# EAGLE schematic octanis_v1 (EAGLE 7.2.0)
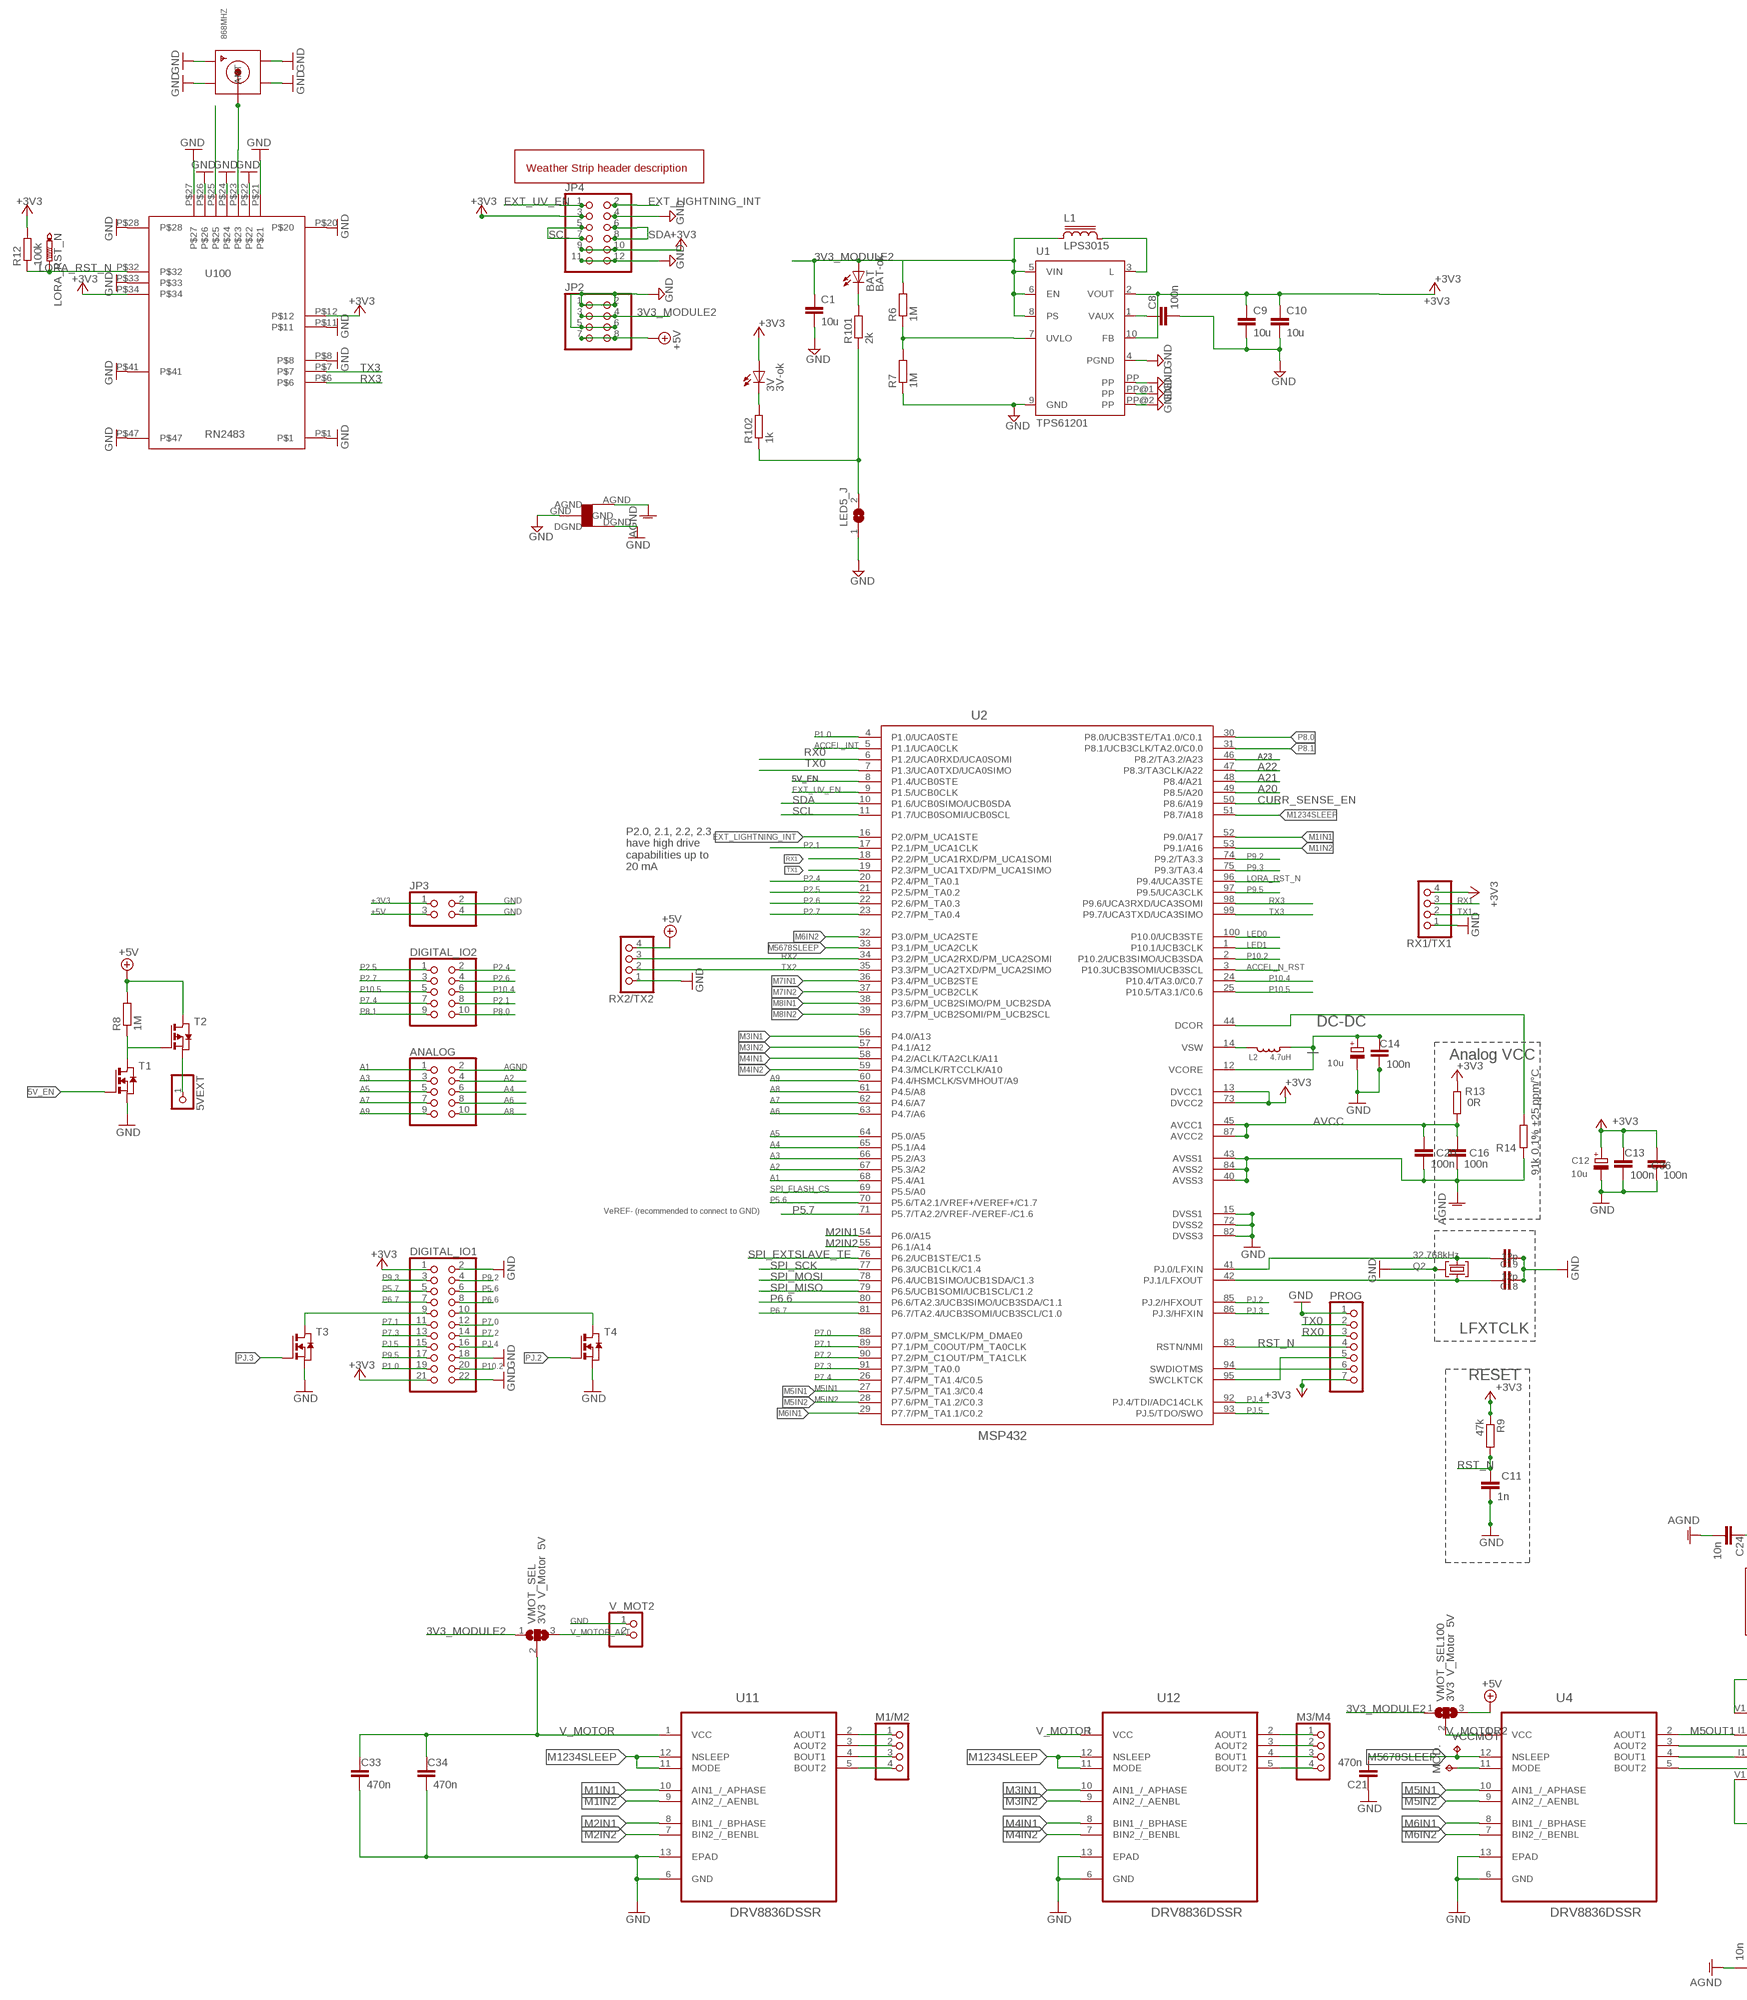
[diagram p0: schematic, sheet 1, part 1 of 2]
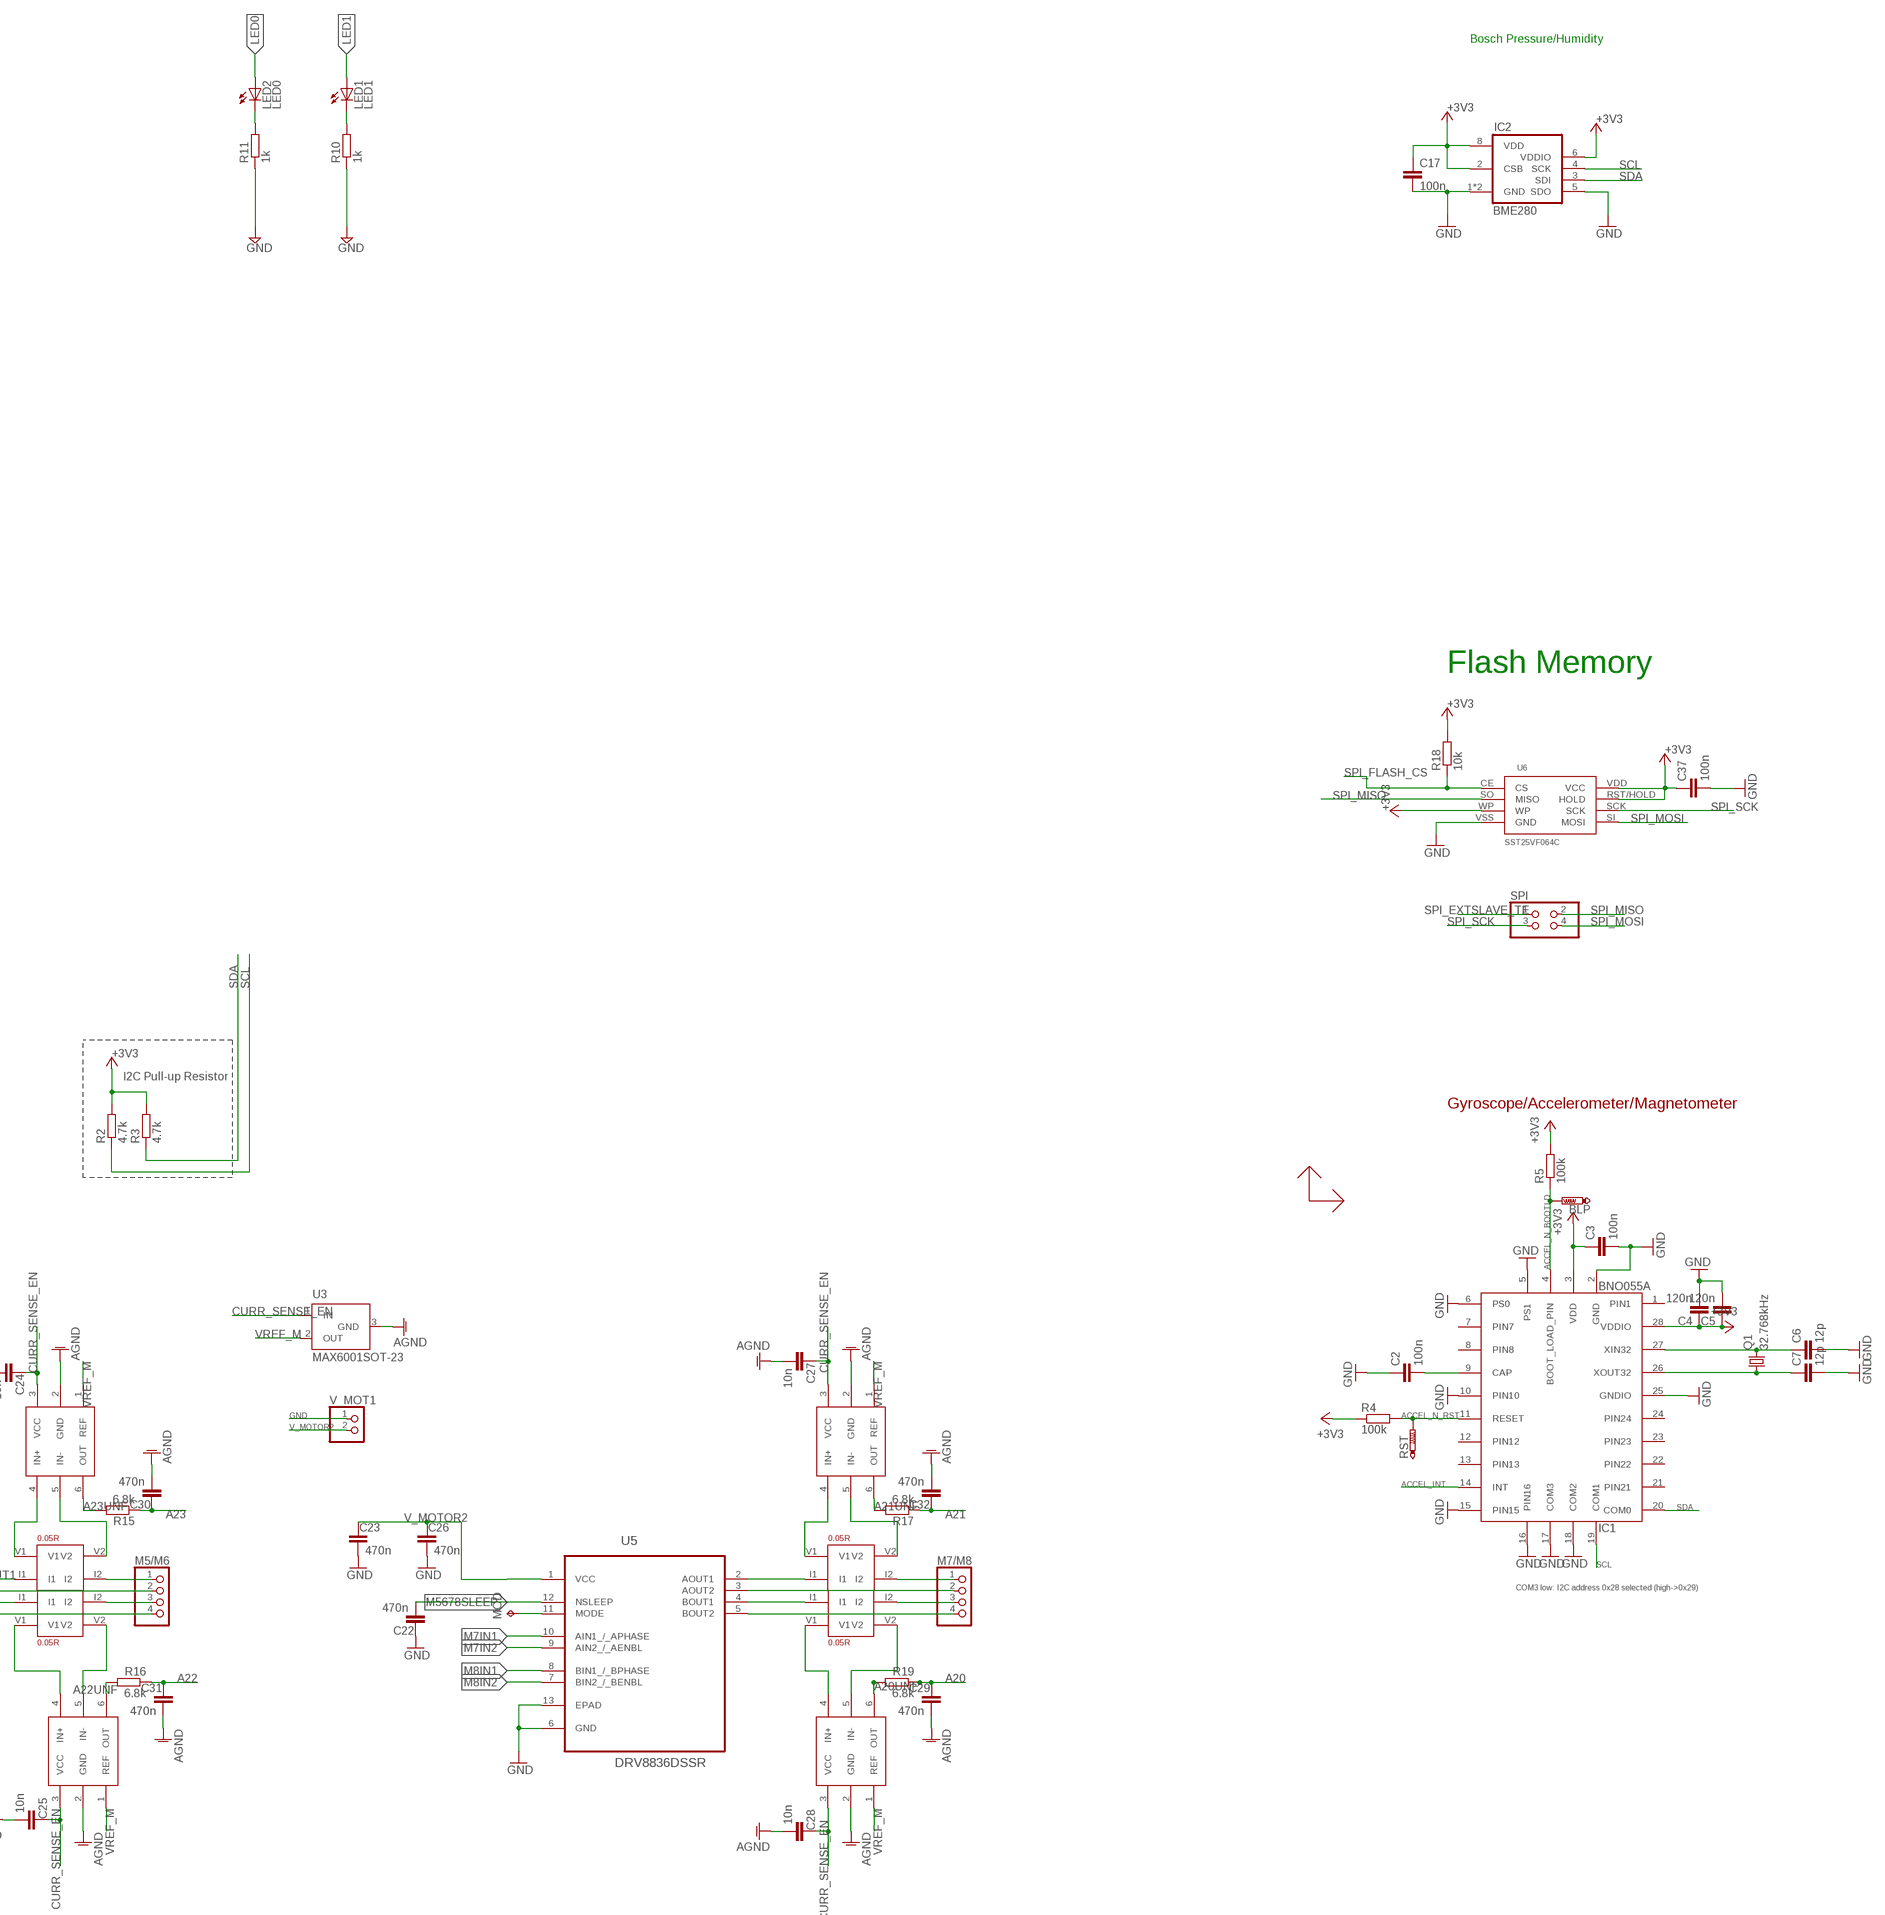
[diagram p1: schematic, sheet 1, part 2 of 2]

## Parts
3V  3V-ok  LEDCHIPLED_0603  [CHIPLED_0603]
5VEXT  PINHD-1X1  [1X01]
868MHZ  SMACONNECTOR_EDGE  [SMA_EDGELAUNCH]
ANALOG  PINHD-2X5  [2X05]
BAT  BAT-ok  LEDCHIPLED_0603  [CHIPLED_0603]
BLP  PTR1B1,27  [B1,27]
C1  10u  C-EUC0805K  [C0805K]
C2  100n  C-EUC0603  [C0603]
C3  100n  C-EUC0603  [C0603]
C4  120n  C-EUC0603  [C0603]
C5  120n  C-EUC0603  [C0603]
C6  12p  C-EUC0603  [C0603]
C7  12p  C-EUC0603  [C0603]
C8  100n  C-EUC0603  [C0603]
C9  10u  C-EUC0805K  [C0805K]
C10  10u  C-EUC0805K  [C0805K]
C11  1n  C-EUC0603  [C0603]
C12  10u  CPOL-EUA/3216-18R  [A/3216-18R]
C13  100n  C-EUC0603  [C0603]
C14  100n  C-EUC0603  [C0603]
C15  10u  CPOL-EUA/3216-18R  [A/3216-18R]
C16  100n  C-EUC0402  [C0402]
C17  100n  C-EUC0603  [C0603]
C18  12p  C-EUC0402  [C0402]
C19  12p  C-EUC0402  [C0402]
C20  100n  C-EUC0402  [C0402]
C21  470n  C-EUC0603  [C0603]
C22  470n  C-EUC0603  [C0603]
C23  470n  C-EUC0603  [C0603]
C24  10n  C-EUC0603  [C0603]
C25  10n  C-EUC0603  [C0603]
C26  470n  C-EUC0603  [C0603]
C27  10n  C-EUC0603  [C0603]
C28  10n  C-EUC0603  [C0603]
C29  470n  C-EUC0603  [C0603]
C30  470n  C-EUC0603  [C0603]
C31  470n  C-EUC0603  [C0603]
C32  470n  C-EUC0603  [C0603]
C33  470n  C-EUC0603  [C0603]
C34  470n  C-EUC0603  [C0603]
C36  100n  C-EUC0603  [C0603]
C37  100n  C-EUC0603  [C0603]
DIGITAL_IO1  PINHD-2X11  [2X11]
DIGITAL_IO2  PINHD-2X5  [2X05]
IC1  BNO055A  [BNO055]
IC2  BME280  [BME280]
JP2  PINHD-2X04_2.54  [2X04]
JP3  PINHD-2X2  [2X02]
JP4  PINHD-2X06_2.54-SMD  [2X06SMD]
L1  LPS3015  [LPS3015]
L2  4.7uH  LQM2MP_G0  [0806]
LED1  LED1  LEDCHIPLED_0603  [CHIPLED_0603]
LED2  LED0  LEDCHIPLED_0603  [CHIPLED_0603]
LED5_J  SJ  [SJ]
LORA_RST_N  PTR1TP15R  [TP15R]
M1/M2  PINHD-1X04_2.54-S  [1X04-S]
M3/M4  PINHD-1X04_2.54-S  [1X04-S]
M5/M6  PINHD-1X04_2.54-S  [1X04-S]
M7/M8  PINHD-1X04_2.54-S  [1X04-S]
MOD  TPTP06R  [TP06R]
MOD.  TPTP06R  [TP06R]
PROG  PINHD-1X72MM_SMD  [1X7SMD]
Q1  32.768kHz  FC-12M  [FC-12M]
Q2  32.768kHz  MS3V-T1R  [MS3V-T1R]
R2  4.7k  R-EU_R0603  [R0603]
R3  4.7k  R-EU_R0603  [R0603]
R4  100k  R-EU_R0603  [R0603]
R5  100k  R-EU_R0603  [R0603]
R6  1M  R-EU_R0603  [R0603]
R7  1M  R-EU_R0603  [R0603]
R8  1M  R-EU_R0603  [R0603]
R9  47k  R-EU_R0603  [R0603]
R10  1k  R-EU_R0603  [R0603]
R11  1k  R-EU_R0603  [R0603]
R12  100k  R-EU_R0603  [R0603]
R13  0R  R-EU_R0402  [R0402]
R14  91k 0.1% ±25 ppm/°C  R-EU_R0402  [R0402]
R15  6.8k  R-EU_R0603  [R0603]
R16  6.8k  R-EU_R0603  [R0603]
R17  6.8k  R-EU_R0603  [R0603]
R18  10k  R-EU_R0603  [R0603]
R19  6.8k  R-EU_R0603  [R0603]
R101  2k  R-EU_R0603  [R0603]
R102  1k  R-EU_R0603  [R0603]
RS1  0.05R  CURRENT_RESISTOR  [4PADS_RESISTOR]
RS2  0.05R  CURRENT_RESISTOR  [4PADS_RESISTOR]
RS3  0.05R  CURRENT_RESISTOR  [4PADS_RESISTOR]
RS4  0.05R  CURRENT_RESISTOR  [4PADS_RESISTOR]
RST  PTR1B1,27  [B1,27]
RX1/TX1  PINHD-1X04_2.54-S  [1X04-S]
RX2/TX2  PINHD-1X04_2.54-S  [1X04-S]
SPI  PINHD-2X2  [2X02]
T1  NMOSSOT23  [SOT-23]
T2  PMOSSOT23  [SOT-23]
T3  NMOSSOT23  [SOT-23]
T4  NMOSSOT23  [SOT-23]
U1  TPS61201  [S-PDSO-N10]
U2  MSP432  [PZ100]
U3  MAX6001SOT-23  [MAX6001]
U4  DRV8836DSSR  [SON50P200X300X80-13N]
U5  DRV8836DSSR  [SON50P200X300X80-13N]
U6  SST25VF064C  [SOIC_8-LEAD]
U7  INA210  INA213  [SC70-6]
U8  INA210  INA213  [SC70-6]
U9  INA210  INA213  [SC70-6]
U10  INA210  INA213  [SC70-6]
U11  DRV8836DSSR  [SON50P200X300X80-13N]
U12  DRV8836DSSR  [SON50P200X300X80-13N]
U100  RN2483  [RN2483]
U$1  WEATHER_STRIP_DOCU  [WEATHER_STRIP_DOCU]
U$2  STARGND  [STAR]
U$3  BNO055_COORDINATES  [BNO055_COORDINATES]
V_MOT1  PINHD-1X02_2.54-S  [1X02-S]
V_MOT2  PINHD-1X02_2.54-S  [1X02-S]
VCCMOT  TPTP06R  [TP06R]
VMOT_SEL  3V3 V_Motor 5V  SJ2W  [SJ_2]
VMOT_SEL100  3V3 V_Motor 5V  SJ2W  [SJ_2]

## Nets
3V3_MODULE2 [power]: BAT.A C1.1 JP2.3 JP2.4 L1.1 R6.2 U1.5(VIN) U1.6(EN) U1.8(PS) VMOT_SEL100.1 VMOT_SEL.1
5V_EN: T1.3(G) U2.8(P1.4/UCB0STE)
+3V3 [power]: 3V.A C3.1 C4.1 C5.1 C9.1 C10.1 C12.+ C13.2 C17.1 C36.2 C37.1 DIGITAL_IO1.1 DIGITAL_IO1.21 IC1.3(VDD) IC1.28(VDDIO) IC2.2(CSB) IC2.6(VDDIO) IC2.8(VDD) JP3.1 JP4.3 JP4.9 JP4.10 PROG.7 R2.2 R3.2 R4.1 R5.2 R9.1 R12.2 R13.2 R18.2 RX1/TX1.4 U1.2(VOUT) U1.10(FB) U2.13(DVCC1) U2.73(DVCC2) U6.RST/HOLD(HOLD) U6.VDD(VCC) U6.WP U100.P$12 U100.P$34
+5V [fine]: JP2.7 JP2.8 JP3.3 R8.2 RX2/TX2.4 T2.1(D) VMOT_SEL100.3
A1: ANALOG.1 U2.68(P5.4/A1)
A2: ANALOG.4 U2.67(P5.3/A2)
A3: ANALOG.3 U2.66(P5.2/A3)
A4: ANALOG.6 U2.65(P5.1/A4)
A5: ANALOG.5 U2.64(P5.0/A5)
A6: ANALOG.8 U2.63(P4.7/A6)
A7: ANALOG.7 U2.62(P4.6/A7)
A8: ANALOG.10 U2.61(P4.5/A8)
A9: ANALOG.9 U2.60(P4.4/HSMCLK/SVMHOUT/A9)
A20: C29.2 R19.1 U2.49(P8.5/A20)
A20UNF: R19.2 U10.6(OUT)
A21: C32.2 R17.1 U2.48(P8.4/A21)
A21UNF: R17.2 U9.6(OUT)
A22: C31.2 R16.1 U2.47(P8.3/TA3CLK/A22)
A22UNF: R16.2 U8.6(OUT)
A23: C30.2 R15.1 U2.46(P8.2/TA3.2/A23)
A23UNF: R15.2 U7.6(OUT)
ACCEL_INT: IC1.14(INT) U2.5(P1.1/UCA0CLK)
ACCEL_N_BOOTLD: BLP.TP IC1.4(BOOT_LOAD_PIN) R5.1
ACCEL_N_RST: IC1.11(RESET) R4.2 RST.TP U2.3(P10.3UCB3SOMI/UCB3SCL)
AGND [power]: ANALOG.2 C16.2 C20.2 C24.1 C25.1 C27.1 C28.1 C29.1 C30.1 C31.1 C32.1 R14.2 U2.40(AVSS3) U2.43(AVSS1) U2.84(AVSS2) U3.3(GND) U7.2(GND) U8.2(GND) U9.2(GND) U10.2(GND) U$2.AGND
ANT433: U100.P$25
ANT868: 868MHZ.P(ANT) U100.P$23
AVCC [VIN]: C16.1 C20.1 R13.1 U2.45(AVCC1) U2.87(AVCC2)
CURR_SENSE_EN [VIN]: C24.2 C25.2 C27.2 C28.2 U2.50(P8.6/A19) U3.1(IN) U7.3(VCC) U8.3(VCC) U9.3(VCC) U10.3(VCC)
EXT_LIGHTNING_INT: JP4.2 U2.16(P2.0/PM_UCA1STE)
EXT_UV_EN: JP4.1 U2.9(P1.5/UCB0CLK)
GND [power]: 868MHZ.GND@1(GND4) 868MHZ.GND@2(GND3) 868MHZ.GND@3(GND2) 868MHZ.GND@4(GND1) C1.2 C2.1 C3.2 C4.2 C5.2 C6.2 C7.2 C8.2 C9.2 C10.2 C11.1 C12.- C13.1 C14.1 C15.- C17.2 C18.1 C19.1 C21.2 C22.2 C23.1 C26.1 C33.1 C34.1 C36.1 C37.2 DIGITAL_IO1.2 DIGITAL_IO1.18 DIGITAL_IO1.22 IC1.2(GND) IC1.5(PS1) IC1.6(PS0) IC1.10(PIN10) IC1.15(PIN15) IC1.16(PIN16) IC1.17(COM3) IC1.18(COM2) IC1.25(GNDIO) IC2.1(GND) IC2.5(SDO) IC2.7(GND) JP2.1 JP2.2 JP2.5 JP2.6 JP3.2 JP3.4 JP4.4 JP4.11 JP4.12 LED5_J.1 PROG.1 Q2.P3(GND) R7.1 R10.1 R11.1 RX1/TX1.1 RX2/TX2.1 T1.2(S) T3.2(S) T4.2(S) U1.4(PGND) U1.9(GND) U1.PP U1.PP@1(PP) U1.PP@2(PP) U2.15(DVSS1) U2.72(DVSS2) U2.82(DVSS3) U4.6(GND) U4.13(EPAD) U5.6(GND) U5.13(EPAD) U6.VSS(GND) U11.6(GND) U11.13(EPAD) U12.6(GND) U12.13(EPAD) U100.P$1 U100.P$8 U100.P$11 U100.P$20 U100.P$21 U100.P$22 U100.P$24 U100.P$26 U100.P$27 U100.P$28 U100.P$33 U100.P$41 U100.P$47 U$2.DGND U$2.GND V_MOT1.1 V_MOT2.1
L: L1.2 U1.3(L)
LED0: LED2.A U2.100(P10.0/UCB3STE)
LED1: LED1.A U2.1(P10.1/UCB3CLK)
LORA_RST_N: LORA_RST_N.TP R12.1 U2.96(P9.4/UCA3STE) U100.P$32
M1IN1: U2.52(P9.0/A17) U11.10(AIN1_/_APHASE)
M1IN2: U2.53(P9.1/A16) U11.9(AIN2_/_AENBL)
M2IN1: U2.54(P6.0/A15) U11.8(BIN1_/_BPHASE)
M2IN2: U2.55(P6.1/A14) U11.7(BIN2_/_BENBL)
M3IN1: U2.56(P4.0/A13) U12.10(AIN1_/_APHASE)
M3IN2: U2.57(P4.1/A12) U12.9(AIN2_/_AENBL)
M4IN1: U2.58(P4.2/ACLK/TA2CLK/A11) U12.8(BIN1_/_BPHASE)
M4IN2: U2.59(P4.3/MCLK/RTCCLK/A10) U12.7(BIN2_/_BENBL)
M5IN1: U2.27(P7.5/PM_TA1.3/C0.4) U4.10(AIN1_/_APHASE)
M5IN2: U2.28(P7.6/PM_TA1.2/C0.3) U4.9(AIN2_/_AENBL)
M5OUT1: RS1.I1 U4.2(AOUT1)
M6IN1: U2.29(P7.7/PM_TA1.1/C0.2) U4.8(BIN1_/_BPHASE)
M6IN2: U2.32(P3.0/PM_UCA2STE) U4.7(BIN2_/_BENBL)
M7IN1: U2.36(P3.4/PM_UCB2STE) U5.10(AIN1_/_APHASE)
M7IN2: U2.37(P3.5/PM_UCB2CLK) U5.9(AIN2_/_AENBL)
M8IN1: U2.38(P3.6/PM_UCB2SIMO/PM_UCB2SDA) U5.8(BIN1_/_BPHASE)
M8IN2: U2.39(P3.7/PM_UCB2SOMI/PM_UCB2SCL) U5.7(BIN2_/_BENBL)
M1234SLEEP: U2.51(P8.7/A18) U11.11(MODE) U11.12(NSLEEP) U12.11(MODE) U12.12(NSLEEP)
M5678SLEEP: C21.1 C22.1 U2.33(P3.1/PM_UCA2CLK) U4.12(NSLEEP) U5.12(NSLEEP) VCCMOT.TP
N$1: C14.2 C15.+ L2.1 U2.12(VCORE)
N$2: C8.1 U1.1(VAUX)
N$4: 3V.C R102.2
N$5: LED2.C R11.2
N$6: LED1.C R10.2
N$8: C18.2 Q2.P2 U2.41(PJ.0/LFXIN)
N$10: C19.2 Q2.P1 U2.42(PJ.1/LFXOUT)
N$13: M3/M4.1 U12.2(AOUT1)
N$14: R8.1 T1.1(D) T2.3(G)
N$15: RS1.V2 U7.5(IN-)
N$17: RS1.V1 U7.4(IN+)
N$18: C2.2 IC1.9(CAP)
N$19: C6.1 IC1.27(XIN32) Q1.2
N$20: MOD.TP U5.11(MODE)
N$21: M5/M6.1 RS1.I2
N$22: MOD..TP U4.11(MODE)
N$23: RS2.V1 U8.4(IN+)
N$24: RS2.V2 U8.5(IN-)
N$25: RS2.I1 U4.4(BOUT1)
N$26: LED5_J.2 R101.1 R102.1
N$27: M5/M6.3 RS2.I2
N$28: RS3.V2 U9.5(IN-)
N$29: RS3.V1 U9.4(IN+)
N$30: RS4.V2 U10.5(IN-)
N$31: RS4.V1 U10.4(IN+)
N$32: M7/M8.1 RS3.I2
N$33: R14.1 U2.44(DCOR)
N$34: L2.2 U2.14(VSW)
N$35: RS4.I1 U5.4(BOUT1)
N$36: RS3.I1 U5.2(AOUT1)
N$37: M7/M8.3 RS4.I2
N$38: M5/M6.2 U4.3(AOUT2)
N$39: M3/M4.2 U12.3(AOUT2)
N$40: M3/M4.3 U12.4(BOUT1)
N$41: M3/M4.4 U12.5(BOUT2)
N$42 [power]: R6.1 R7.2 U1.7(UVLO)
N$43: M5/M6.4 U4.5(BOUT2)
N$44: BAT.C R101.2
N$45: M7/M8.4 U5.5(BOUT2)
N$46: DIGITAL_IO1.9 T3.1(D)
N$47: 5VEXT.1 T2.2(S)
N$49: M1/M2.1 U11.2(AOUT1)
N$50: M1/M2.2 U11.3(AOUT2)
N$51: M1/M2.3 U11.4(BOUT1)
N$52: M1/M2.4 U11.5(BOUT2)
N$54: M7/M8.2 U5.3(AOUT2)
N$55: DIGITAL_IO1.10 T4.1(D)
N$73: C7.1 IC1.26(XOUT32) Q1.1
N$76: PROG.6 U2.94(SWDIOTMS)
N$77: PROG.5 U2.95(SWCLKTCK)
P1.0: DIGITAL_IO1.19 U2.4(P1.0/UCA0STE)
P2.1: DIGITAL_IO2.8 U2.17(P2.1/PM_UCA1CLK)
P2.4: DIGITAL_IO2.2 U2.20(P2.4/PM_TA0.1)
P2.5: DIGITAL_IO2.1 U2.21(P2.5/PM_TA0.2)
P2.6: DIGITAL_IO2.4 U2.22(P2.6/PM_TA0.3)
P2.7: DIGITAL_IO2.3 U2.23(P2.7/PM_TA0.4)
P5.6: DIGITAL_IO1.6 U2.70(P5.6/TA2.1/VREF+/VEREF+/C1.7)
P5.7 [power]: DIGITAL_IO1.5 U2.71(P5.7/TA2.2/VREF-/VEREF-/C1.6)
P6.6: DIGITAL_IO1.8 U2.80(P6.6/TA2.3/UCB3SIMO/UCB3SDA/C1.1)
P6.7: DIGITAL_IO1.7 U2.81(P6.7/TA2.4/UCB3SOMI/UCB3SCL/C1.0)
P7.0: DIGITAL_IO1.12 U2.88(P7.0/PM_SMCLK/PM_DMAE0)
P7.1: DIGITAL_IO1.11 U2.89(P7.1/PM_C0OUT/PM_TA0CLK)
P7.2: DIGITAL_IO1.14 U2.90(P7.2/PM_C1OUT/PM_TA1CLK)
P7.3: DIGITAL_IO1.13 U2.91(P7.3/PM_TA0.0)
P7.4: DIGITAL_IO2.7 U2.26(P7.4/PM_TA1.4/C0.5)
P8.0: DIGITAL_IO2.10 U2.30(P8.0/UCB3STE/TA1.0/C0.1)
P8.1: DIGITAL_IO2.9 U2.31(P8.1/UCB3CLK/TA2.0/C0.0)
P9.2: DIGITAL_IO1.4 U2.74(P9.2/TA3.3)
P9.3: DIGITAL_IO1.3 U2.75(P9.3/TA3.4)
P9.5: DIGITAL_IO1.17 U2.97(P9.5/UCA3CLK)
P10.2: DIGITAL_IO1.20 U2.2(P10.2/UCB3SIMO/UCB3SDA)
P10.4: DIGITAL_IO2.6 U2.24(P10.4/TA3.0/C0.7)
P10.5: DIGITAL_IO2.5 U2.25(P10.5/TA3.1/C0.6)
PJ.2: T4.3(G) U2.85(PJ.2/HFXOUT)
PJ.3: T3.3(G) U2.86(PJ.3/HFXIN)
PJ.4: DIGITAL_IO1.16 U2.92(PJ.4/TDI/ADC14CLK)
PJ.5: DIGITAL_IO1.15 U2.93(PJ.5/TDO/SWO)
RST_N: C11.2 PROG.4 R9.2 U2.83(RSTN/NMI)
RX0: PROG.3 U2.6(P1.2/UCA0RXD/UCA0SOMI)
RX1: RX1/TX1.3 U2.18(P2.2/PM_UCA1RXD/PM_UCA1SOMI)
RX2: RX2/TX2.3 U2.34(P3.2/PM_UCA2RXD/PM_UCA2SOMI)
RX3: U2.98(P9.6/UCA3RXD/UCA3SOMI) U100.P$6
SCL: IC1.19(COM1) IC2.4(SCK) JP4.5 JP4.7 R2.1 U2.11(P1.7/UCB0SOMI/UCB0SCL)
SDA: IC1.20(COM0) IC2.3(SDI) JP4.6 JP4.8 R3.1 U2.10(P1.6/UCB0SIMO/UCB0SDA)
SPI_EXTSLAVE_TE: SPI.1 U2.76(P6.2/UCB1STE/C1.5)
SPI_FLASH_CS: R18.1 U2.69(P5.5/A0) U6.CE(CS)
SPI_MISO: SPI.2 U2.79(P6.5/UCB1SOMI/UCB1SCL/C1.2) U6.SO(MISO)
SPI_MOSI: SPI.4 U2.78(P6.4/UCB1SIMO/UCB1SDA/C1.3) U6.SI(MOSI)
SPI_SCK: SPI.3 U2.77(P6.3/UCB1CLK/C1.4) U6.SCK
TX0: PROG.2 U2.7(P1.3/UCA0TXD/UCA0SIMO)
TX1: RX1/TX1.2 U2.19(P2.3/PM_UCA1TXD/PM_UCA1SIMO)
TX2: RX2/TX2.2 U2.35(P3.3/PM_UCA2TXD/PM_UCA2SIMO)
TX3: U2.99(P9.7/UCA3TXD/UCA3SIMO) U100.P$7
V_MOTOR [fine]: C33.2 C34.2 U11.1(VCC) U12.1(VCC) VMOT_SEL.2
V_MOTOR2 [fine]: C23.2 C26.2 U4.1(VCC) U5.1(VCC) V_MOT1.2 VMOT_SEL100.2
V_MOTOR_ALT [fine]: V_MOT2.2 VMOT_SEL.3
VREF_M [power]: U3.2(OUT) U7.1(REF) U8.1(REF) U9.1(REF) U10.1(REF)
Unconnected: IC1.1(PIN1) IC1.7(PIN7) IC1.8(PIN8) IC1.12(PIN12) IC1.13(PIN13) IC1.21(PIN21) IC1.22(PIN22) IC1.23(PIN23) IC1.24(PIN24)

## Notes on the sheet
- Bosch Pressure/Humidity
- Flash Memory
- P2.0, 2.1, 2.2, 2.3
  have high drive 
  capabilities up to
  20 mA
- DC-DC
- Analog VCC
- VeREF- (recommended to connect to GND)
- I2C Pull-up Resistor
- Gyroscope/Accelerometer/Magnetometer
- LFXTCLK
- RESET
- COM3 low: I2C address 0x28 selected (high->0x29)

## Library data of the parts
3V BAT LED1 LED2 = adafruit:LED: LED OSRAM: - CHIPLED LG R971, LG N971, LY N971, LG Q971, LY Q971, LO R971, LY R971 LH N974, LH R974 LS Q976, LO Q976, LY Q976 LO Q996 - Hyper CHIPLED LW Q18S LB Q993, LB Q99A, LB R99A - SideLED LS A670, LO A670, LY A670, LG A670, LP A670 LB A673, LV A673, LT A673, LW A673 LH A674 LY A675 LS A676, LA A676, LO A676, LY A676, LW A676 LS A679, LY A679, LG A679 - Hyper Micro SIDELED® LS Y876, LA Y876, LO Y876, LY Y876 LT Y87S - SmartLED LW L88C, LW L88S LB L89C, LB L89S, LG L890 LS L89K, LO L89K, LY L89K LS L896, LA L896, LO L896, LY L896 - TOPLED LS T670, LO T670, LY T670, LG T670, LP T670 LSG T670, LSP T670, LSY T670, LOP T670, LYG T670 LG T671, LOG T671, LSG T671 LB T673, LV T673, LT T673, LW T673 LH T674 LS T676, LA T676, LO T676, LY T676, LB T676, LH T676, LSB T676, LW T676 LB T67C, LV T67C, LT T67C, LS T67K, LO T67K, LY T67K, LW E67C LS E67B, LA E67B, LO E67B, LY E67B, LB E67C, LV E67C, LT E67C LW T67C LS T679, LY T679, LG T679 LS T770, LO T770, LY T770, LG T770, LP T770 LB T773, LV T773, LT T773, LW T773 LH T774 LS E675, LA E675, LY E675, LS T675 LS T776, LA T776, LO T776, LY T776, LB T776 LHGB T686 LT T68C, LB T68C - Hyper Mini TOPLED® LB M676 - Mini TOPLED Santana® LG M470 LS M47K, LO M47K, LY M47K Source: http://www.osram.convergy.de/
5VEXT = Headerlibrary:PINHD-1X1: PIN HEADER
868MHZ = sma_end_launch:SMACONNECTOR: SMA Connector 90° DIP SMA Connector, 50 Ohm (4UConnector: 07259)
ANALOG DIGITAL_IO2 = pinhead:PINHD-2X5: PIN HEADER
BLP LORA_RST_N RST = testpad:PTR1: TEST PIN
C1-C11 C13 C14 C16-C34 C36 C37 = rcl:C-EU: CAPACITOR, European symbol
C12 C15 = rcl:CPOL-EU: POLARIZED CAPACITOR, European symbol
DIGITAL_IO1 = pinhead:PINHD-2X11: PIN HEADER
IC1 = BNO055:BNO055
IC2 = bosch-bme280:BME280: DIGITAL HUMIDITY, PRESSURE AND TEMPERATURE SENSOR * Digital interface I²C (up to 3.4 MHz) and SPI (3 and 4 wire, up to 10 MHz)* Supply voltage VDD main supply voltage range: 1.71 V to 3.6 V*VDDIO interface voltage range: 1.2 V to 3.6 V Operating range -40…+85 °C, 0…100 % rel. humidity, 300…1100 hPa The library has been designed by Richard Magdycz <https://www.facebook.com/groups/eaglecadsoftUK>
JP2 = pinhead-2:PINHD-2X04: PIN HEADER
JP3 SPI = pinhead:PINHD-2X2: PIN HEADER
JP4 = pinhead-2:PINHD-2X06: PIN HEADER
L1 = inductor-coilcraft:LPS3015: Shielded Power Inductor
L2 = Murata:LQM2MP_G0
LED5_J = jumper:SJ: SMD solder JUMPER
M1/M2 M3/M4 M5/M6 M7/M8 RX1/TX1 RX2/TX2 = pinhead-2:PINHD-1X04: PIN HEADER
MOD MOD. VCCMOT = testpad:TP: Test pad
PROG = Headerlibrary:PINHD-1X7: PIN HEADER
Q1 = crystal:FC-12M: kHz RANGE CRYSTAL UNIT LOW PROFILE SMD Source: Epson Toyocom FC-12M.pdf; URL: http://www.mouser.ch/ProductDetail/ECS/ECS-327-125-12-TR/?qs=sGAEpiMZZMsBj6bBr9Q9adKxTNdvE4KvM1b8HDkgjuY%3d
Q2 = microcrystal:MS3V-T1R
R2-R19 R101 R102 = rcl:R-EU_: RESISTOR, European symbol
RS1-RS4 = Octanis1_EPS:CURRENT_RESISTOR
T1 T3 T4 = zetex:NMOSSOT23: MOS FET; OC_FARNELL: unknown; OC_NEWARK: unknown
T2 = zetex:PMOSSOT23: MOS FET; OC_FARNELL: unknown; OC_NEWARK: unknown
U1 = texas:TPS6120*: LOW INPUT VOLTAGE SYNCHRONOUS BOOST CONVERTER WITH 1.3-A SWITCHES Source: http://focus.ti.com/lit/ds/symlink/tps61200.pdf; MPN: TPS61201DRCT; OC_FARNELL: unknown; OC_NEWARK: 37M0068
U2 = MSP-EXP432:MSP432
U3 = Octanis1:MAX6001
U4 U5 U11 U12 = DRV8834:DRV8836DSSR: DUAL LOW VOLTAGE H-BRIDGE IC,SON-12; MPN: DRV8836DSSR; OC_FARNELL: 2115236; OC_NEWARK: 94T6066; PACKAGE: SON-12; SUPPLIER: TEXAS INSTRUMENTS
U6 = BertaLib:SST25VF064C
U7-U10 = Octanis1_EPS:INA213: Voltage Output, High or Low Side Measurement, Bi-Directional Zer ø -Drift Series Current-Shunt Monitor
U100 = Octanis1:RN2483: Microchip Low-Power Long Range LoRaTM Technology Transceiver Module
U$1 = Octanis1:WEATHER_STRIP_DOCU
U$2 = lpatiny:STARGND
U$3 = Octanis1:BNO055_COORDINATES
V_MOT1 V_MOT2 = pinhead-2:PINHD-1X02: PIN HEADER
VMOT_SEL VMOT_SEL100 = jumper:SJ2W: SMD solder JUMPER

## Net classes
0 default: width 0.203 mm
1 power: width 0.203 mm, drill 0.305 mm, clearance 0.152 mm
2 VIN: width 0.203 mm, drill 0.305 mm, clearance 0.152 mm
3 fine: width 0.406 mm, drill 0.61 mm, clearance 0.152 mm